# EasyEDA Pro project MasterCtrl.eprj, schematic MasterSchematic_RA

## Sheets
1 MasterCore_RA: Board Name: MasterBoard_RA; Create Date: 2025-10-08; Page Name: MasterCore_RA; Project Name: MasterCtrl; Schematic Name: MasterSchematic_RA; Update Date: 2025-10-08; Company: 嘉立创EDA; Drawed: 王大智; Page Size: A4; Version: V1.0
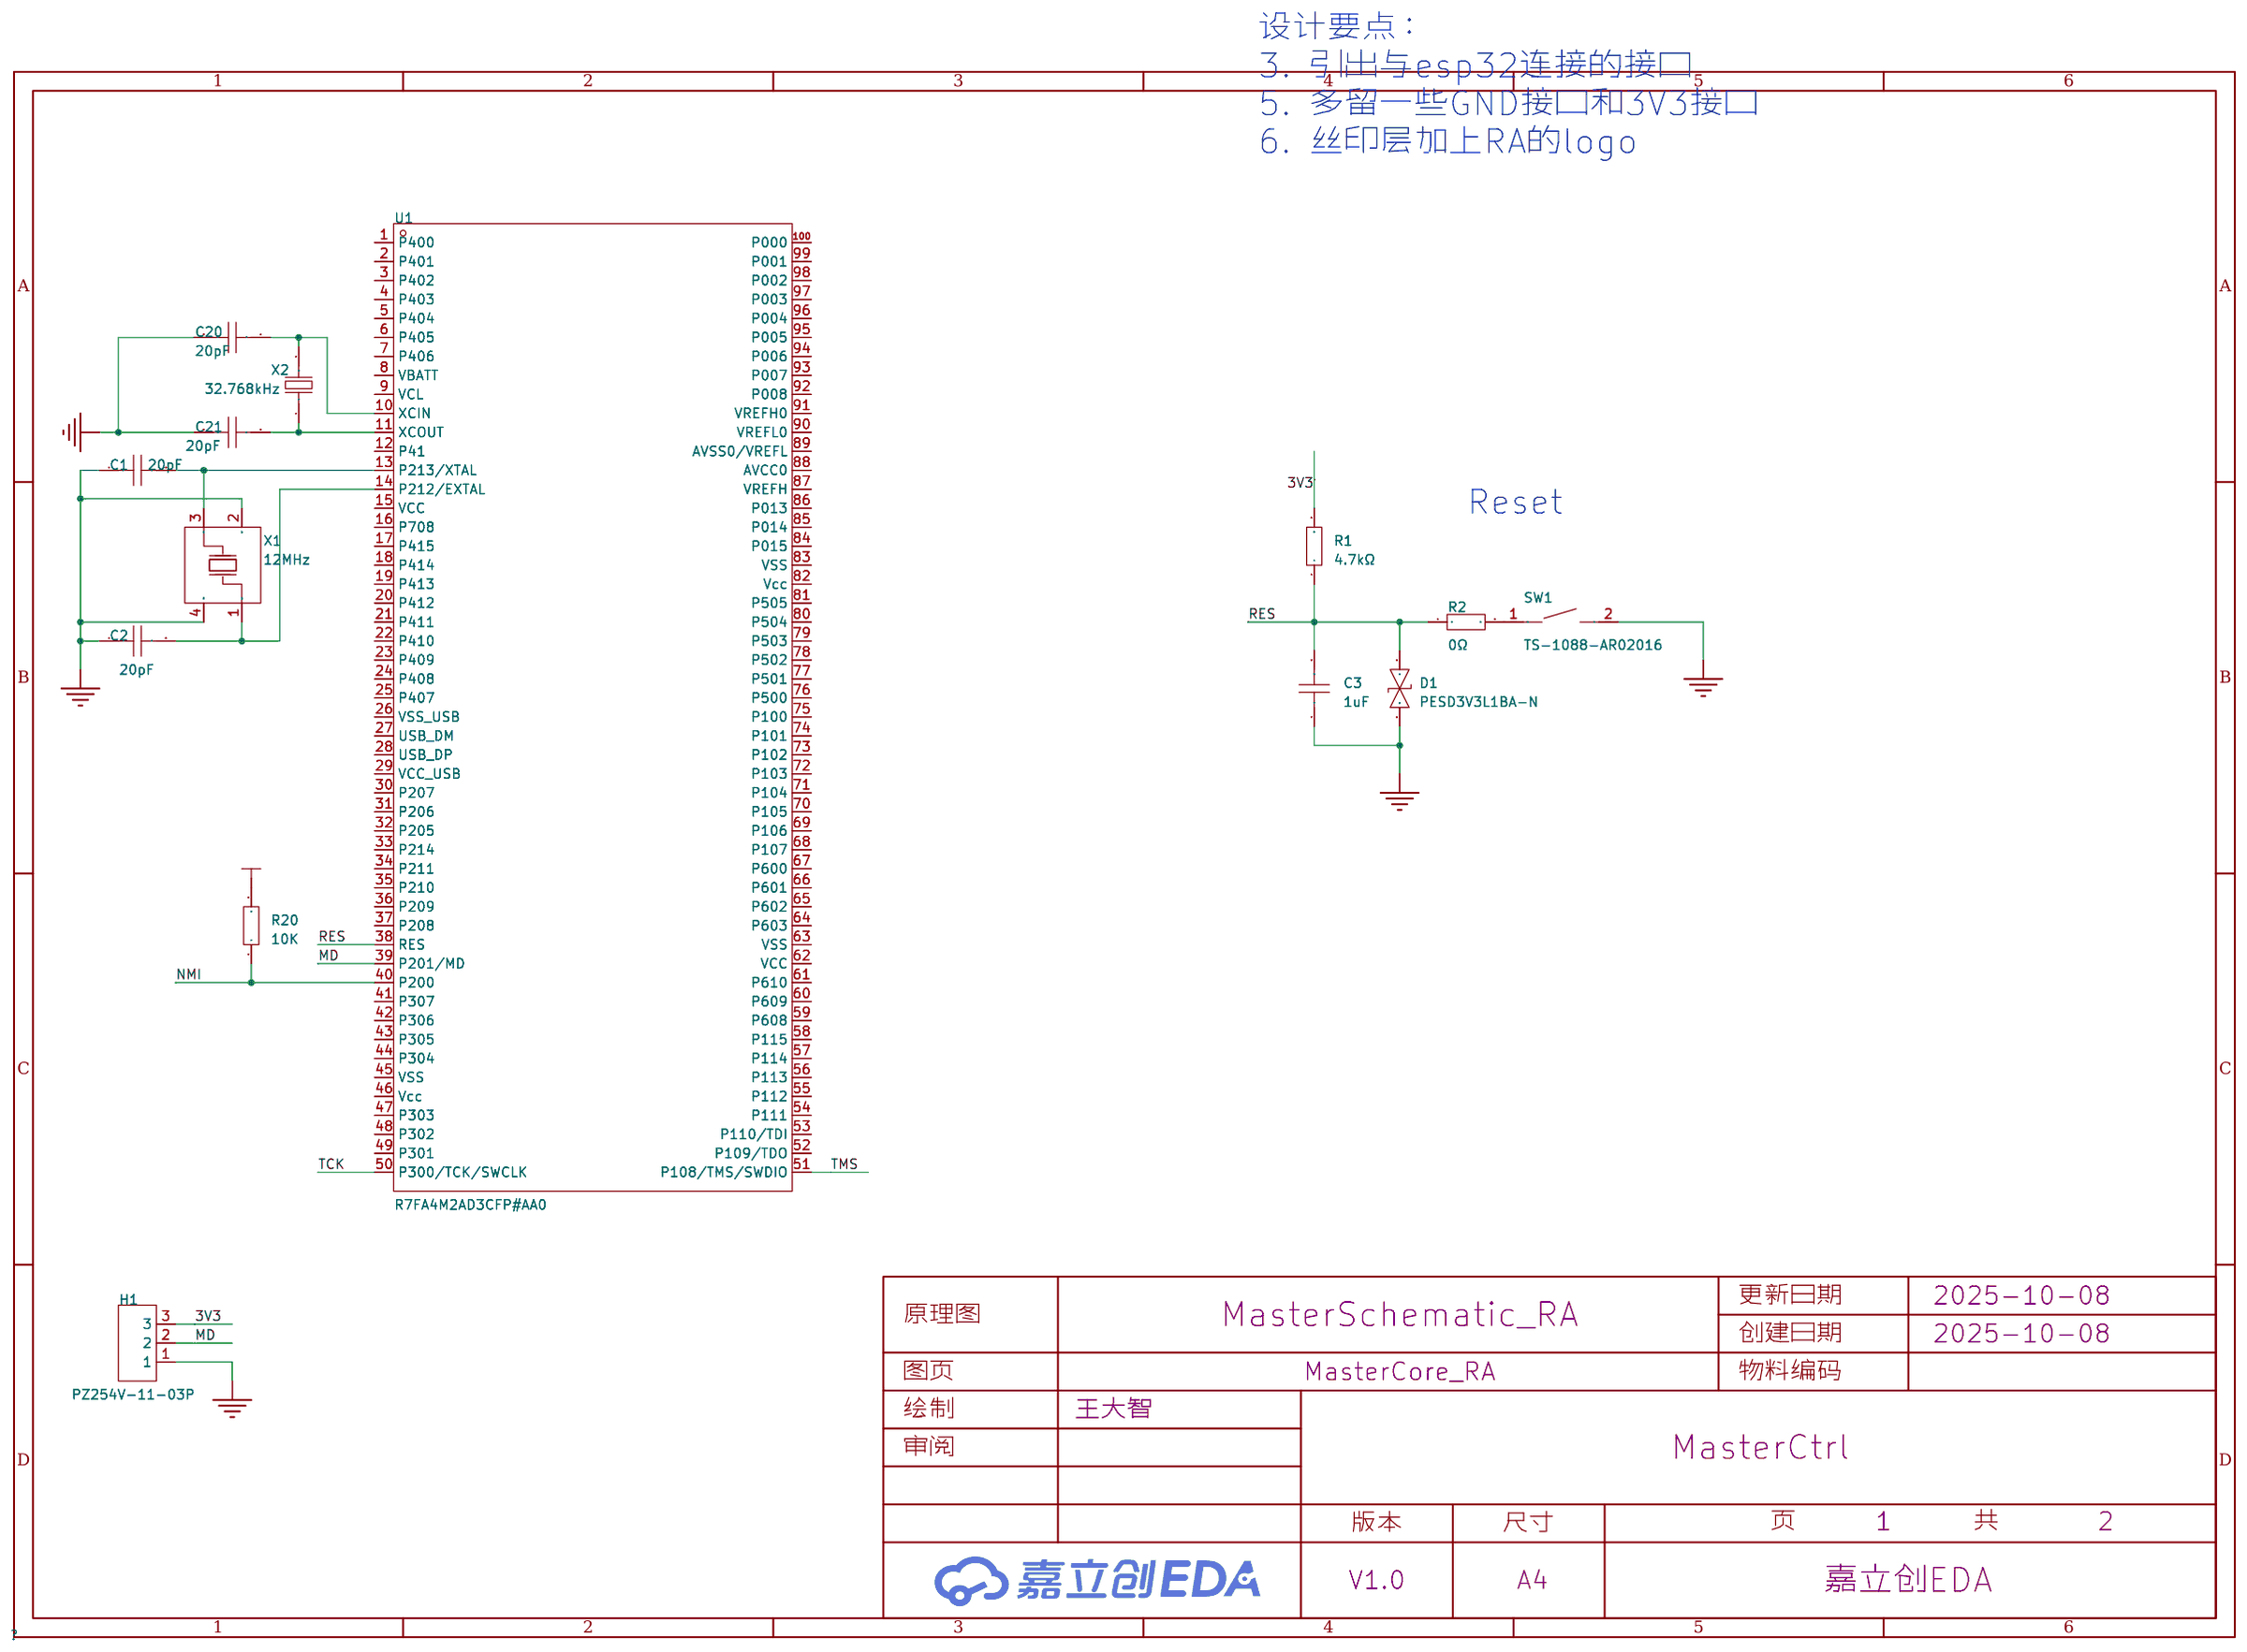
[diagram p4: MasterCore_RA]
2 MasterExternal_RA: Page Name: MasterExternal_RA
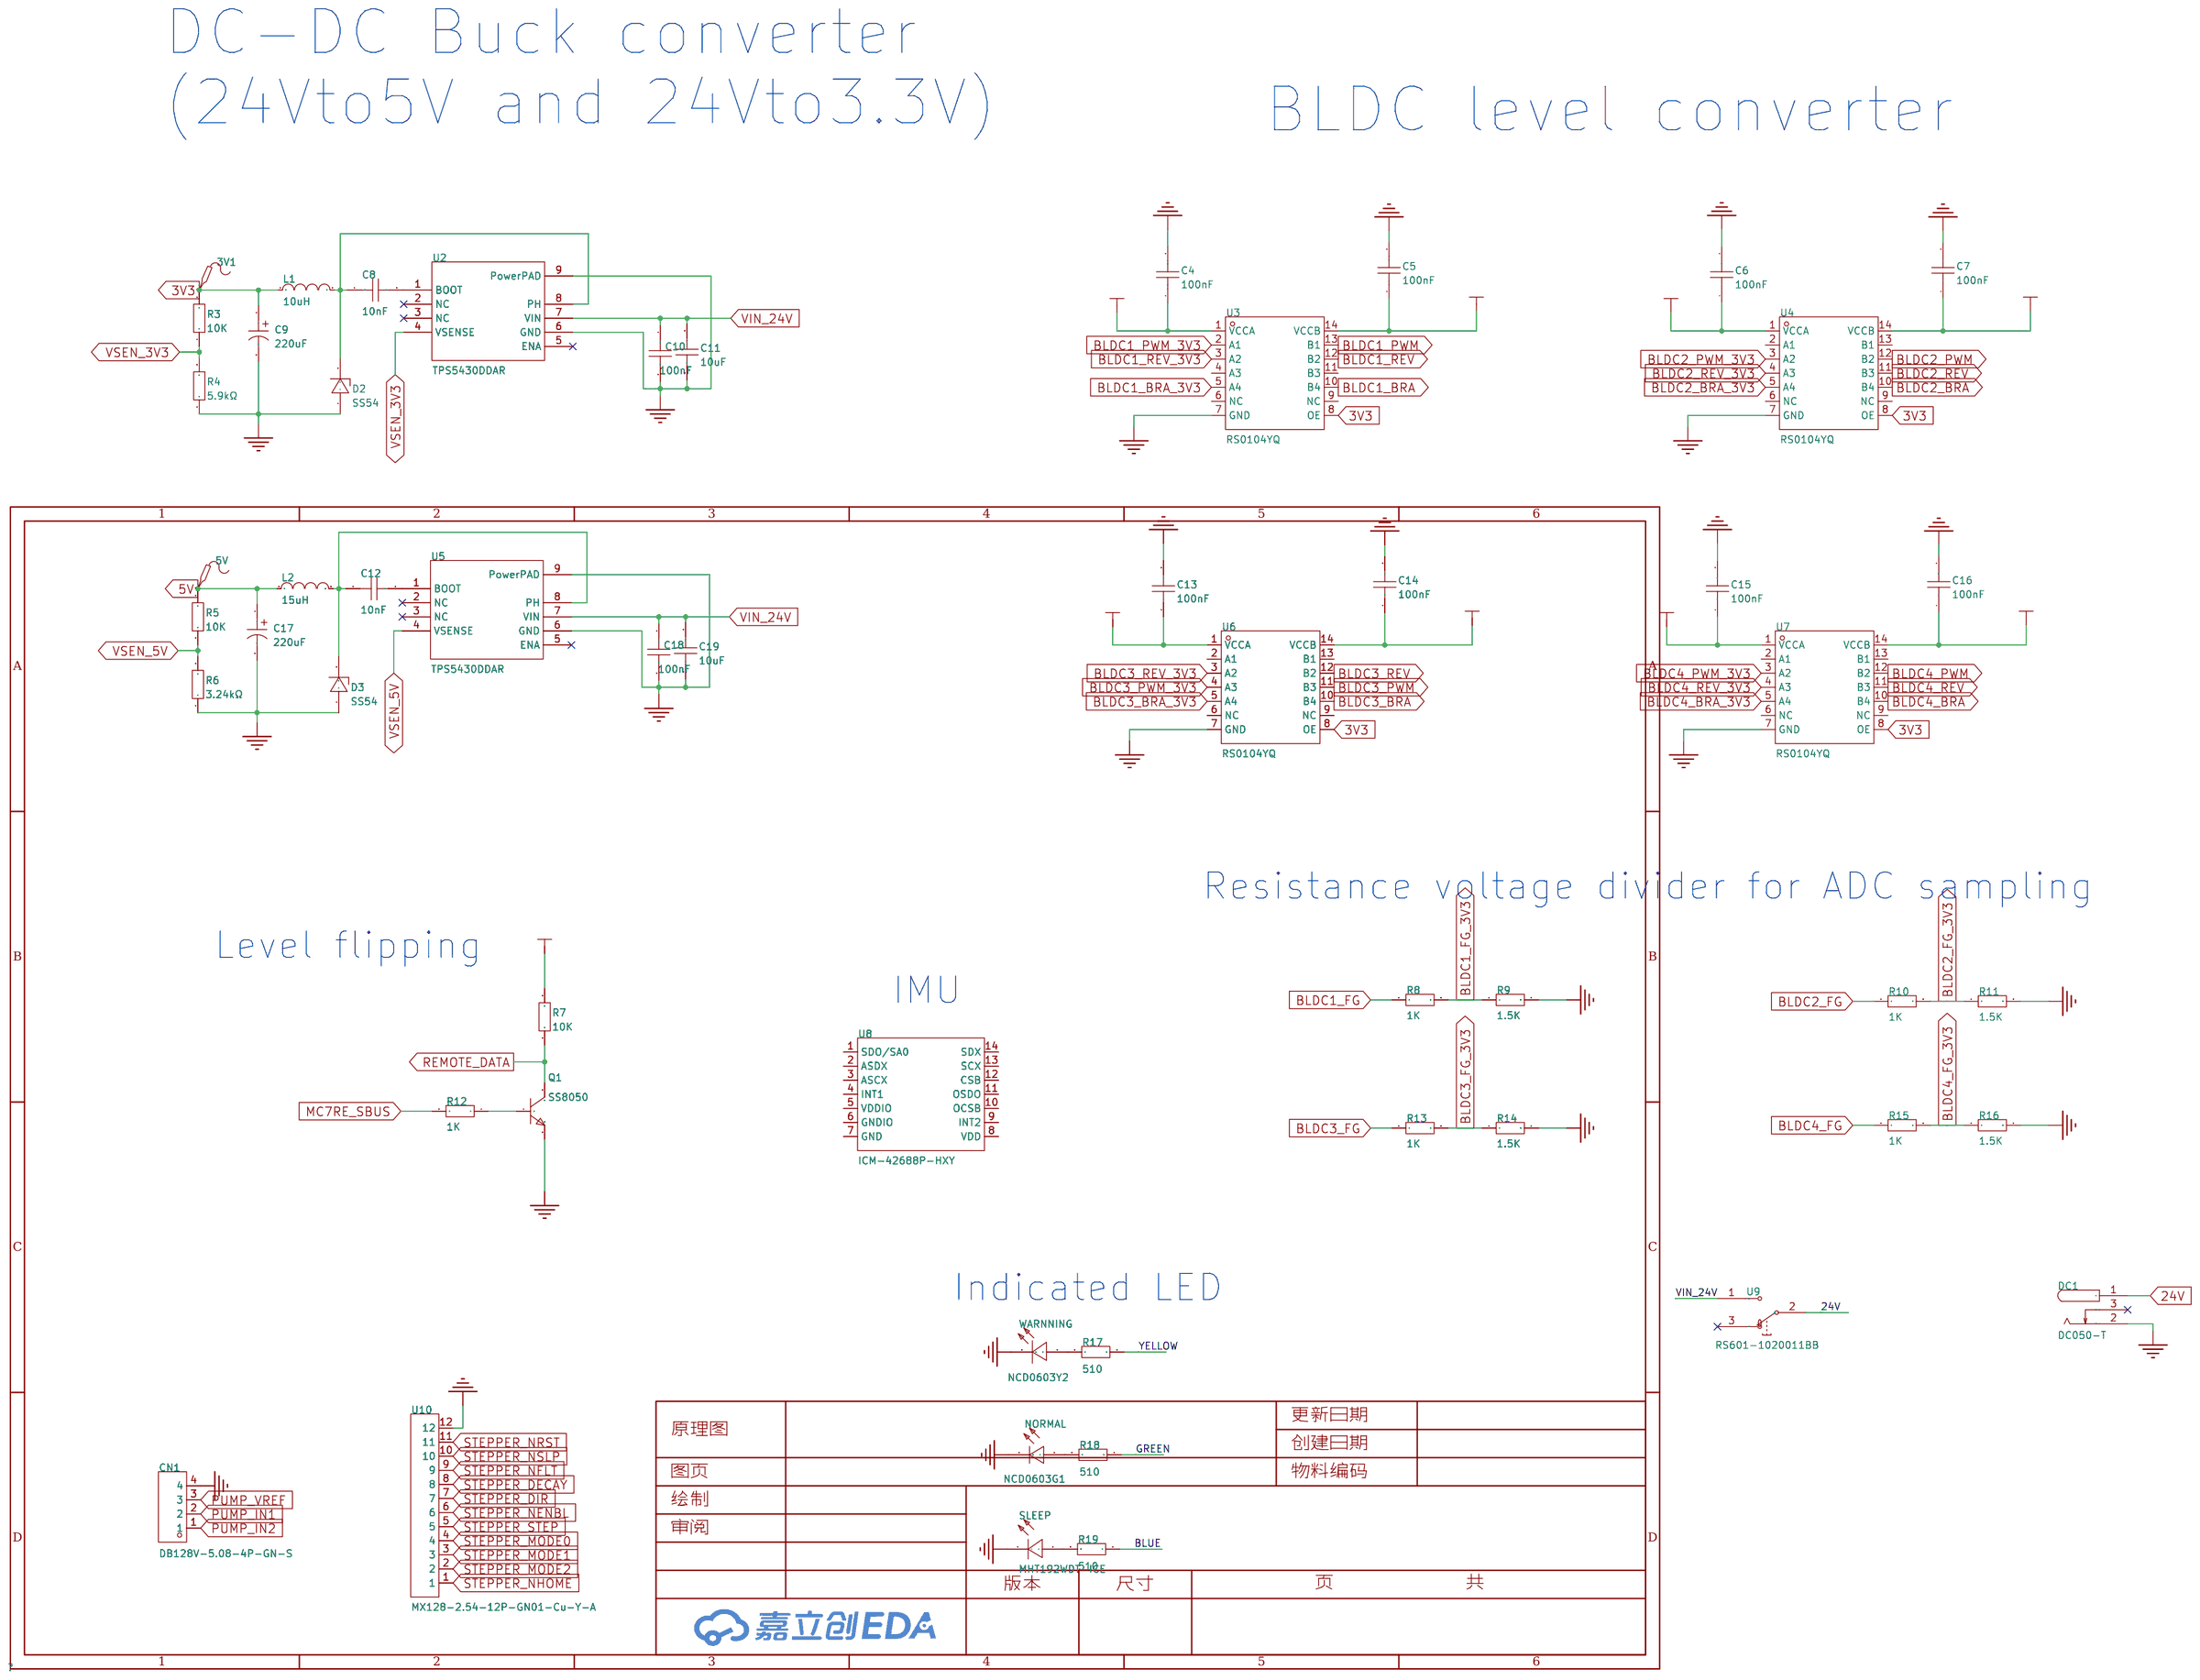
[diagram p5: MasterExternal_RA]

## Parts
sheet MasterCore_RA
C1  20pF  [C0603]
C2  20pF  [C0603]
C3  1uF  [C0603]
C20  20pF  [C0603]
C21  20pF  [C0603]
D1  PESD3V3L1BA-N  [SOD-323_L1.8-W1.3-LS2.5-BI]
H1  PZ254V-11-03P  [HDR-TH_3P-P2.54-V-M]
R1  4.7kΩ  [R0603]
R2  0Ω  [R0603]
R20  10K  [R0603]
SW1  TS-1088-AR02016  [SW-SMD_L3.9-W3.0-P4.45]
U1  R7FA4M2AD3CFP#AA0  [QFP-100_L14.0-W14.0-P0.50-LS16.0-BL]
X1  12MHz  [CRYSTAL-SMD_4P-L3.2-W2.5-BL]
X2  32.768kHz  [FC-135R_L3.2-W1.5]
sheet MasterExternal_RA
3V1  -  [Test-Point-0.5mm]
5V  -  [Test-Point-0.5mm]
C4  100nF  [C0603]
C5  100nF  [C0603]
C6  100nF  [C0603]
C7  100nF  [C0603]
C8  10nF  [C0603]
C9  220uF  [CAP-SMD_BD8.0-L8.3-W8.3-FD]
C10  100nF  [C0603]
C11  10uF  [C1206]
C12  10nF  [C0603]
C13  100nF  [C0603]
C14  100nF  [C0603]
C15  100nF  [C0603]
C16  100nF  [C0603]
C17  220uF  [CAP-SMD_BD8.0-L8.3-W8.3-FD]
C18  100nF  [C0603]
C19  10uF  [C1206]
CN1  DB128V-5.08-4P-GN-S  [CONN-TH_4P-P5.08_DIBO_DB128V-5.08]
D2  SS54  [SMA_L4.3-W2.6-LS5.0-FD]
D3  SS54  [SMA_L4.3-W2.6-LS5.0-FD]
DC1  DC050-T  [DC-IN_DC050-T]
L1  10uH  [IND-SMD_L7.3-W6.8]
L2  15uH  [IND-SMD_L7.0-W6.6_FXL0630]
NORMAL  NCD0603G1  [LED0603-RD_1]
Q1  SS8050  [SOT-23-3_L2.9-W1.3-P1.90-LS2.4-BR]
R3  10K  [R0603]
R4  5.9kΩ  [R0603]
R5  10K  [R0603]
R6  3.24kΩ  [R0603]
R7  10K  [R0603]
R8  1K  [R0603]
R9  1.5K  [R0603]
R10  1K  [R0603]
R11  1.5K  [R0603]
R12  1K  [R0603]
R13  1K  [R0603]
R14  1.5K  [R0603]
R15  1K  [R0603]
R16  1.5K  [R0603]
R17  510  [R0603]
R18  510  [R0603]
R19  510  [R0603]
SLEEP  MHT192WDT-ICE  [LED0603-RD]
U2  TPS5430DDAR  [ESOP-8_L4.9-W3.9-P1.27-LS6.0-TL-EP]
U3  RS0104YQ  [TSSOP-14_L5.0-W4.4-P0.65-LS6.4-BL]
U4  RS0104YQ  [TSSOP-14_L5.0-W4.4-P0.65-LS6.4-BL]
U5  TPS5430DDAR  [ESOP-8_L4.9-W3.9-P1.27-LS6.0-TL-EP]
U6  RS0104YQ  [TSSOP-14_L5.0-W4.4-P0.65-LS6.4-BL]
U7  RS0104YQ  [TSSOP-14_L5.0-W4.4-P0.65-LS6.4-BL]
U8  ICM-42688P-HXY  [LGA-14_L3.0-W2.5-P0.50-TL]
U9  RS601-1020011BB  [SW-TH_RS601-1020011BB]
U10  MX128-2.54-12P-GN01-Cu-Y-A  [CONN-TH_12P-P2.54_MX128-2.54-12P-GN01-CU-Y-A]
WARNNING  NCD0603Y2  [LED0603-RD]

## Library data of the parts
C1 C2 C4-C8 C10 C12-C16 C18 C20 C21 = CAP_0603: Supplier Footprint: 0603
C3 = CL10A105KB8NNNC: LCSC Part Name: 1uF ±10% 50V; Supplier Part: C15849; Manufacturer: SAMSUNG(三星); Supplier Footprint: 0603; JLCPCB Part Class: 基础库; Datasheet: https://item.szlcsc.com/datasheet/CL10A105KB8NNNC/16531.html; Supplier: LCSC; Tolerance: ±10%; Voltage Rating: 50V; Temperature Coefficient: X5R
D1 = PESD3V3L1BA-N: LCSC Part Name: 双向ESD 3.3V截止 峰值浪涌电流：20A@8/20us; Supplier Part: C316020; Manufacturer: BORN(伯恩半导体); Supplier Footprint: SOD-323; JLCPCB Part Class: 扩展库; Datasheet: https://item.szlcsc.com/datasheet/PESD3V3L1BA-N/297708.html; Supplier: LCSC; Polarity: 双向; Reverse Stand-Off Voltage (Vrwm): 3.3V; Clamping Voltage: 24V; Peak Pulse Current (Ipp): 20A@8/20us; Peak Pulse Power Dissipation (Ppp): 480W@8/20us; Voltage - Breakdown: 4V; Reverse Leakage Current (Ir): 1uA; level of protection: IEC 61000-4-4；IEC 61000-4-5；IEC 61000-4-2; Type: ESD; Junction Capacitance: 100pF
H1 = PZ254V-11-03P: LCSC Part Name: 1x3P 间距:2.54mm 方针 直插; Supplier Part: C2937625; Manufacturer: XFCN(兴飞); Supplier Footprint: 插件,P=2.54mm; JLCPCB Part Class: 扩展库; Datasheet: https://item.szlcsc.com/datasheet/PZ254V-11-03P/3293280.html; Supplier: LCSC; Pin Structure: 1x3P; Pitch: 2.54mm; Circluar Pins/Square Pins: 方针; Mounting Type: 直插; Number of Rows: 单排; Number of Pins: 3P; Current Rating: 3A; Voltage Rating (Max): 250V; Length of Mating Pin: 6mm; Insulation Height: 2.5mm; Length of End Connection Pin: 3mm; Operating Temperature: -40℃~+105℃; Color: 黑色
R1 = 0603WAF4701T5E: LCSC Part Name: 4.7kΩ ±1% 100mW 厚膜电阻; Supplier Part: C23162; Manufacturer: UNI-ROYAL(厚声); Supplier Footprint: 0603; JLCPCB Part Class: 基础库; Datasheet: https://item.szlcsc.com/datasheet/0603WAF4701T5E/23889.html; Supplier: LCSC; Type: 厚膜电阻; Tolerance: ±1%; Power(Watts): 100mW; Voltage-Supply(Max): 75V; Temperature Coefficient: ±100ppm/℃; Operating Temperature: -55℃~+155℃
R2 = 0603WAF0000T5E: LCSC Part Name: 0Ω ±1% 100mW 厚膜电阻; Supplier Part: C21189; Manufacturer: UNI-ROYAL(厚声); Supplier Footprint: 0603; JLCPCB Part Class: 基础库; Datasheet: https://item.szlcsc.com/datasheet/0603WAF0000T5E/21903.html; Supplier: LCSC; Type: 厚膜电阻; Tolerance: ±1%; Power(Watts): 100mW; Voltage-Supply(Max): 75V; Operating Temperature: -55℃~+155℃
R3 R5 R7-R20 = Res_0603: Supplier Footprint: 0603
SW1 = TS-1088-AR02016: 电路结构:单刀单掷;按钮形状:圆形按钮;作用力:160gf;安装方式:立贴;开关长度:4mm;开关宽度:3mm;开关高度:2mm;带支架:不带;触点电流:50mA;额定电压(DC):12V;绝缘电阻:100MΩ;机械寿命:10万次;; LCSC Part Name: 4*3*2mm 立贴 轻触开关; Supplier Part: C720477; Manufacturer: XUNPU(讯普); Supplier Footprint: SMD; JLCPCB Part Class: 扩展库; Datasheet: https://atta.szlcsc.com/upload/public/pdf/source/20200810/C720475_60D09DD6C54279ADDB2DC25100F1CC11.pdf; Supplier: LCSC; Circuit: 单刀单掷; Actuator Style: 圆形按钮; Operating Force: 160gf; Mounting Style: 立贴; Switch Length: 4mm; Switch Width: 3mm; Switch Height: 2mm; Strike Gundam: 不带; Contact Current: 50mA; Voltage Rating (DC): 12V; Insulation Resistance: 100MΩ; Actuator/Cap Color: 黑色; Pin Style: SMD接片; Mechanical Life: 10万次; Operating Temperature: -30℃~+80℃
U1 = R7FA4M2AD3CFP#AA0: Supplier Part: C2760247; Manufacturer: RENESAS(瑞萨)/IDT; Supplier Footprint: QFP-100(14x14); JLCPCB Part Class: 扩展库; Datasheet: https://atta.szlcsc.com/upload/public/pdf/source/20220506/333544AE3475D49B174406464DEBF319.pdf; Supplier: LCSC; CPU Core: ARM-M33; CPU Maximum Speed: 100MHz; Program Storage Size: 512KB; EEPROM: 8KB; Number of I/O: 78; ADC (Bit): 12bit; DAC (Bit): 12bit; Voltage - Supply: 2.7V~3.6V
X1 = X322512MSB4SI: 晶振类型:贴片晶振;频率:12MHz;常温频差:±10ppm;负载电容:20pF;频率稳定度:±20ppm;; LCSC Part Name: YSX321SL 12MHZ 4P 3225 20PF ±10PPM -40~85℃ (±20PPM); Supplier Part: C9002; Manufacturer: YXC(扬兴晶振); Supplier Footprint: SMD3225-4P; JLCPCB Part Class: 基础库; Datasheet: https://atta.szlcsc.com/upload/public/pdf/source/20240329/19D5F850207469550BEB00D7DFEDBC7A.pdf; Supplier: LCSC; Type: 贴片晶振; Normal temperature Frequency Tolerance: ±10ppm; Load Capacitance: 20pF; Frequency Stability: ±20ppm; Operating Temperature: -40℃~+85℃
X2 = Q13FC13500004_C32346: 晶振类型:贴片晶振;频率:32.768kHz;常温频差:±20ppm;负载电容:12.5pF;; LCSC Part Name: 32.768kHz ±20ppm 12.5pF; Supplier Part: C32346; Manufacturer: EPSON(爱普生); Manufacturer Part: Q13FC13500004; Supplier Footprint: SMD3215-2P; JLCPCB Part Class: 基础库; Datasheet: https://atta.szlcsc.com/upload/public/pdf/source/20240418/0E0FF5F0356BA3753F616001439D1416.pdf; Supplier: LCSC; Crystal Type: 贴片晶振; Normal temperature Frequency Tolerance: ±20ppm; Load Capacitor: 12.5pF; Equivalent Series Resistance (ESR): 70kΩ; Operating Temperature: -40℃~+85℃
3V1 5V = Test-Point: Test Point 测试点
C9 C17 = GVT1V227M0810CNVC: 容值:220uF;精度:±20%;额定电压:35V;纹波电流:175mA@120Hz;; LCSC Part Name: 220uF ±20% 35V; Supplier Part: C2983323; Manufacturer: HRK(鸿瑞凯电子); Supplier Footprint: SMD,D8xL10.5mm; JLCPCB Part Class: 扩展库; Datasheet: https://atta.szlcsc.com/upload/public/pdf/source/20220321/BA17E910A44EA2B508CDD6AB8BA576BA.pdf; Supplier: LCSC; Tolerance: ±20%; Rated Voltage: 35V; Ripple Current: 175mA@120Hz; φD: 8mm; L: 10.5mm; Lifetime @ Temp: 2000hrs@105℃; Operating Temperature: -55℃~+105℃
C11 C19 = HGC1206R5106K500NSPJ: 容值:10uF;精度:±10%;额定电压:50V;温度系数:X5R;; LCSC Part Name: 10uF ±10% 50V; Supplier Part: C7432781; Manufacturer: Chinocera(华瓷); Supplier Footprint: 1206; JLCPCB Part Class: 扩展库; Datasheet: https://atta.szlcsc.com/upload/public/pdf/source/20240320/FAC3FEC40A78BC5CCCE96C232A94D860.pdf; Supplier: LCSC; Tolerance: ±10%; Voltage Rating: 50V; Temperature Coefficient: X5R
CN1 = DB128V-5.08-4P-GN-S: 结构:1x4P;间距:5.08mm;颜色:绿色;安装方式:直插;排数:1;每排PIN数:4;额定电流:16A;额定电压:300V;线规 - AWG:12~22;线规 - 平方毫米:2.5;工作温度:-40℃~+105℃;; LCSC Part Name: 1x4P 5.08mm 直插 排数:1 每排P数:4; Supplier Part: C2915641; Manufacturer: DORABO(地博电气); Supplier Footprint: 插件,P=5.08mm; JLCPCB Part Class: 扩展库; Datasheet: https://atta.szlcsc.com/upload/public/pdf/source/20230106/CC449C10514519CDCE20F1C37DBF2DAC.pdf; Supplier: LCSC; Number of Positions or Pins: 1x4P; Pitch: 5.08mm; Color: 绿色; Mounting Type: 直插; Number of Pins: 4P; Number of Rows: 1; Number of PINs Per Row: 4; Screw Specification: M2.5; Current Rating: 16A; Voltage Rating (Max): 300V; Wire Gauge - AWG: 12~22; Wire Gauge - mm2: 2.5; Operating Temperature: -40℃~+105℃
D2 D3 = SS54_C7420369: 二极管配置:独立式;正向压降(Vf):550mV@5.0A;直流反向耐压(Vr):40V;整流电流:5A;; LCSC Part Name: 电压:40V 电流:5A; Supplier Part: C7420369; Manufacturer: 宏迦橙; Supplier Footprint: SMA(DO-214AC); JLCPCB Part Class: 扩展库; Datasheet: https://atta.szlcsc.com/upload/public/pdf/source/20230828/254C3882F8647358AD9F60DD73611B5E.pdf; Supplier: LCSC; Diode Configuration: 独立式; Forward Voltage (Vf@If): 550mV@5.0A; Reverse Voltage (Vr): 40V; Rectified Current: 5A; Reverse Leakage Current (Ir): 50uA@40V
DC1 = DC050-T: 连接器类型:DC电源插座;安装方式:卧贴;触点内径:2mm;触点外径:6.4mm;额定电流:2A;额定电压:30V;工作温度范围:-25℃~+70℃;; LCSC Part Name: DC电源插座 内径:2mm 外径:6.4mm; Supplier Part: C431534; Manufacturer: SHOU HAN(首韩); Supplier Footprint: SMD; JLCPCB Part Class: 扩展库; Datasheet: https://atta.szlcsc.com/upload/public/pdf/source/20241230/47AFDAED5CA2AEF49E0D72E48671546A.pdf; Supplier: LCSC; Connector Type: DC电源插座; Mounting Style: 卧贴; Inside Contact Diameter: 2mm; Outside Contact Diameter: 6.4mm; Current Rating (Max): 2A; Voltage Rating (Max): 30V; Operating Temperature Range: -25℃~+70℃
L1 = FXL0630-100-M: 电感值:10uH;精度:±20%;额定电流:4.5A;饱和电流(Isat):5.5A;类型:一体成型电感;; LCSC Part Name: 10uH ±20% 5.5A; Supplier Part: C167223; Manufacturer: cjiang(长江微电); Supplier Footprint: SMD,6.6x7mm; JLCPCB Part Class: 扩展库; Datasheet: https://atta.szlcsc.com/upload/public/pdf/source/20240426/3189EA8206330E2108542F9E34E540E7.pdf; Supplier: LCSC; Tolerance: ±20%; Rated Current: 4.5A; Saturation Current (Isat): 5.5A; DC Resistance (DCR): 68mΩ; Type: 一体成型电感
L2 = FXL0630-150-M: 电感值:15uH;精度:±20%;额定电流:3A;饱和电流(Isat):4.5A;类型:一体成型电感;; LCSC Part Name: 15uH ±20% 4.5A; Supplier Part: C177243; Manufacturer: cjiang(长江微电); Supplier Footprint: SMD,6.6x7mm; JLCPCB Part Class: 扩展库; Datasheet: https://atta.szlcsc.com/upload/public/pdf/source/20240426/3189EA8206330E2108542F9E34E540E7.pdf; Supplier: LCSC; Tolerance: ±20%; Rated Current: 3A; Saturation Current (Isat): 4.5A; DC Resistance (DCR): 115mΩ; Type: 一体成型电感
NORMAL = NCD0603G1: 发光颜色:翠绿色;正向压降(Vf):2.6V~3.6V;功率:72mW;正向电流:20mA;波长:515nm~530nm;透镜颜色:-;发光强度:330mcd~900mcd;发光角度:130°;工作温度:-30℃~+85℃;; Supplier Part: C84267; Manufacturer: 国星光电; Supplier Footprint: 0603; JLCPCB Part Class: 扩展库; Datasheet: https://item.szlcsc.com/datasheet/NCD0603G1/85436.html; Supplier: LCSC; Illumination Color: 翠绿色; Voltage - Forward(Vf): 2.6V~3.6V; Power(Watts): 72mW; Forward Current: 20mA; Wavelength - Dominant: 515nm~530nm; Luminous Intensity: 330mcd~900mcd; Viewing Angle: 130°; Operating Temperature: -30℃~+85℃
Q1 = SS8050_C7420370: 晶体管类型:NPN;集电极电流(Ic):1.5A;集射极击穿电压(Vceo):25V;耗散功率(Pd):300mW;直流电流增益(hFE):120@100mA,1.0V;; LCSC Part Name: H档 200-350; Supplier Part: C7420370; Manufacturer: 宏嘉诚; Supplier Footprint: SOT-23; JLCPCB Part Class: 扩展库; Datasheet: https://atta.szlcsc.com/upload/public/pdf/source/20250205/5DB94E86981B5B1A1866D18E379C0D4F.pdf; Supplier: LCSC; type: NPN; Current - Collector(Ic): 1.5A; Collector - Emitter Voltage VCEO: 25V; Pd - Power Dissipation: 300mW; DC Current Gain: 120@100mA,1.0V; Transition frequency(fT): 100MHz; Current - Collector Cutoff: 100nA; Vce Saturation(VCE(sat)): 500mV; Operating Temperature: -55℃~+150℃
R4 = 0603WAF5901T5E: 电阻类型:厚膜电阻;阻值:5.9kΩ;精度:±1%;功率:100mW;最大工作电压:75V;温度系数:±100ppm/℃;; LCSC Part Name: 5.9kΩ ±1% 100mW 厚膜电阻; Supplier Part: C23071; Manufacturer: UNI-ROYAL(厚声); Supplier Footprint: 0603; JLCPCB Part Class: 扩展库; Datasheet: https://atta.szlcsc.com/upload/public/pdf/source/20200306/C422600_1E6D84923E4A46A82E41ADD87F860B5C.pdf; Supplier: LCSC; Type: 厚膜电阻; Tolerance: ±1%; Power(Watts): 100mW; Overload Voltage (Max): 75V; Temperature Coefficient: ±100ppm/℃; Operating Temperature Range: -55℃~+155℃
R6 = 0603WAF3241T5E: 电阻类型:厚膜电阻;阻值:3.24kΩ;精度:±1%;功率:100mW;最大工作电压:75V;温度系数:±100ppm/℃;; LCSC Part Name: 3.24kΩ ±1% 100mW 厚膜电阻; Supplier Part: C22994; Manufacturer: UNI-ROYAL(厚声); Supplier Footprint: 0603; JLCPCB Part Class: 扩展库; Datasheet: https://atta.szlcsc.com/upload/public/pdf/source/20200306/C422600_1E6D84923E4A46A82E41ADD87F860B5C.pdf; Supplier: LCSC; Type: 厚膜电阻; Tolerance: ±1%; Power(Watts): 100mW; Overload Voltage (Max): 75V; Temperature Coefficient: ±100ppm/℃; Operating Temperature Range: -55℃~+155℃
SLEEP = MHT192WDT-ICE: 发光颜色:冰蓝色;功率:95mW;正向电流:5mA;主波长:-;二极管配置:-;透镜颜色:雾状黄透镜;色温:-;发光角度:130°;载带方式:-;工作温度:-35℃~+85℃;; LCSC Part Name: 蓝灯 冰蓝; Supplier Part: C389522; Manufacturer: MEIHUA(美华); Supplier Footprint: 0603; JLCPCB Part Class: 扩展库; Datasheet: https://atta.szlcsc.com/upload/public/pdf/source/20190515/C389522_27B43B3FF0A26A72E674F8300763D196.pdf; Supplier: LCSC; Emitted Color: 冰蓝色; Power Dissipation: 95mW; Forward Current: 5mA; Lens Color: 雾状黄透镜; Viewing Angle: 130°; Operating Temperature: -35℃~+85℃
U2 U5 = TPS5430DDAR: 功能类型:降压型;输出类型:可调;工作电压:5.5V~36V;输出电压:1.221V~32.04V;输出电流:3A;; LCSC Part Name: 宽输入范围、3A输出电流的降压转换器; Supplier Part: C9864; Manufacturer: TI(德州仪器); Supplier Footprint: SOIC-8-EP; JLCPCB Part Class: 基础库; Datasheet: https://www.ti.com/cn/lit/gpn/tps5430; Supplier: LCSC; Function: 降压型; Output Type: 可调; Input Voltage: 5.5V~36V; Output Voltage: 1.221V~32.04V; Output Current: 3A; Switching Frequency: 500kHz; Operating Temperature: -40℃~+125℃@(TJ); Synchronous Rectification: 否; Number of Outputs: 1; Topology: 降压式; Switch tube (built-in/external): 内置
U3 U4 U6 U7 = RS0104YQ: 数据速率:24Mbps;电压(VCCA):1.65V~5.5V;电压(VCCB):2.3V~5.5V;电路数:1;每个电路通道数:4;; Supplier Part: C2762288; Manufacturer: RUNIC(润石); Supplier Footprint: TSSOP-14; JLCPCB Part Class: 扩展库; Datasheet: https://atta.szlcsc.com/upload/public/pdf/source/20210326/C2762288_047AD9A0F3596B818F72E78761722A97.pdf; Supplier: LCSC; Channel Type: 双向; Data Rate: 24Mbps; Supply Voltage (VCCA): 1.65V~5.5V; Supply Voltage (VCCB): 2.3V~5.5V; Number of Circuits: 1; Channels per Circuit: 4; Output Type: 推挽式；开路漏极; Operating Temperature: -40℃~+85℃
U8 = ICM-42688P-HXY: Supplier Part: C46550687; Manufacturer: HXY MOSFET(华轩阳电子); Supplier Footprint: LGA-14(2.5x3); JLCPCB Part Class: 扩展库; Datasheet: https://item.szlcsc.com/datasheet/ICM-42688P-HXY/48681527.html; Supplier: LCSC
U9 = RS601-1020011BB: 带灯:无;引脚样式:焊片;额定电流:8A;额定电压(AC):250V;额定电压(DC):-;电路结构:单刀双掷;机械寿命:1万次;; Supplier Part: C2885784; Manufacturer: HCTL(华灿天禄); Supplier Footprint: 插件; JLCPCB Part Class: 扩展库; Datasheet: https://atta.szlcsc.com/upload/public/pdf/source/20210820/EDA204CBF6D3843A462B7BF46F14BDE3.pdf; Supplier: LCSC; Switch Length: 21mm; Switch Width: 15mm; Switch Height: 13.6mm; Actuator Type: 凹面弯曲; With Lamp: 无; Pin Style: 焊片; Actuator Color: 黑色; Contact Current: 8A; Voltage Rating (AC): 250V; Circuit: 单刀双掷; Mechanical Life: 1万次; Operating Temperature: -25℃~+85℃; Actuator Identifier: - O
U10 = MX128-2.54-12P-GN01-Cu-Y-A: 结构:1x12P;间距:2.54mm;颜色:绿色;安装方式:直插;排数:1;每排PIN数:12;额定电流:6A;额定电压:150V;线规 - AWG:18~24;线规 - 平方毫米:1;工作温度:-40℃~+105℃;; LCSC Part Name: 1x12P 2.54mm 直插 排数:1 每排P数:12; Supplier Part: C5188451; Manufacturer: MAX(迈旭); Supplier Footprint: 插件,P=2.54mm; JLCPCB Part Class: 扩展库; Datasheet: https://atta.szlcsc.com/upload/public/pdf/source/20250320/39CF67EAC718F5AC600D0D1AE915BA0E.pdf; Supplier: LCSC; Number of Positions or Pins: 1x12P; Pitch: 2.54mm; Color: 绿色; Mounting Type: 直插; Number of Pins: 12P; Number of Rows: 1; Number of PINs Per Row: 12; Screw Specification: M1.6; Current Rating: 6A; Voltage Rating (Max): 150V; Wire Gauge - AWG: 18~24; Wire Gauge - mm2: 1; Operating Temperature: -40℃~+105℃
WARNNING = NCD0603Y2: 发光颜色:黄色;正向电压(VF):1.6V~2.6V;功率:65mW;正向电流:20mA;主波长:586nm~595nm;透镜颜色:无色透明透镜;发光强度:100mcd~220mcd;发光角度:130°;工作温度:-30℃~+85℃;; Supplier Part: C89811; Manufacturer: 国星光电; Supplier Footprint: 0603; JLCPCB Part Class: 扩展库; Datasheet: https://atta.szlcsc.com/upload/public/pdf/source/20200820/C89811_7FE84B429B6BCA3E113B125EE1452576.pdf; Supplier: LCSC; Emitted Color: 黄色; Forward Voltage (VF): 1.6V~2.6V; Power Dissipation: 65mW; Forward Current: 20mA; Dominant Wavelength: 586nm~595nm; Lens Color: 无色透明透镜; Luminous Intensity: 100mcd~220mcd; Viewing Angle: 130°; Operating Temperature: -30℃~+85℃

## Nets
3V3: 3V1.1 C4.1 C6.1 C9.1 C13.1 C15.1 H1.3 L1.1 R1.2 R3.2 R7.2 R20.2 U3.1(VCCA) U3.8(OE) U4.1(VCCA) U4.8(OE) U6.1(VCCA) U6.8(OE) U7.1(VCCA) U7.8(OE)
5V: 5V.1 C5.1 C7.1 C14.1 C16.1 C17.1 L2.1 R5.2 U3.14(VCCB) U4.14(VCCB) U6.14(VCCB) U7.14(VCCB)
24V: DC1.1 U9.2
GND: C1.1 C2.1 C3.1 C4.2 C5.2 C6.2 C7.2 C9.2 C10.2 C11.1 C13.2 C14.2 C15.2 C16.2 C17.2 C18.2 C19.1 C20.2 C21.2 CN1.4 D1.2 D2.1(A) D3.1(A) DC1.2 H1.1 NORMAL.1(K) Q1.2(E) R4.1 R6.1 R9.2 R11.2 R14.2 R16.2 SLEEP.1(-) SW1.2 U2.6(GND) U2.9(PowerPAD) U3.7(GND) U4.7(GND) U5.6(GND) U5.9(PowerPAD) U6.7(GND) U7.7(GND) U10.12 WARNNING.1(K) X1.2(GND) X1.4(GND)
VIN_24V: C10.1 C11.2 C18.1 C19.2 U2.7(VIN) U5.7(VIN) U9.1
BLDC1_BRA: U3.10(B4)
BLDC1_BRA_3V3: U3.5(A4)
BLDC1_FG: R8.1
BLDC1_FG_3V3: R8.2 R9.1
BLDC1_PWM: U3.13(B1)
BLDC1_PWM_3V3: U3.2(A1)
BLDC1_REV: U3.12(B2)
BLDC1_REV_3V3: U3.3(A2)
BLDC2_BRA: U4.10(B4)
BLDC2_BRA_3V3: U4.5(A4)
BLDC2_FG: R10.1
BLDC2_FG_3V3: R10.2 R11.1
BLDC2_PWM: U4.12(B2)
BLDC2_PWM_3V3: U4.3(A2)
BLDC2_REV: U4.11(B3)
BLDC2_REV_3V3: U4.4(A3)
BLDC3_BRA: U6.10(B4)
BLDC3_BRA_3V3: U6.5(A4)
BLDC3_FG: R13.1
BLDC3_FG_3V3: R13.2 R14.1
BLDC3_PWM: U6.11(B3)
BLDC3_PWM_3V3: U6.4(A3)
BLDC3_REV: U6.12(B2)
BLDC3_REV_3V3: U6.3(A2)
BLDC4_BRA: U7.10(B4)
BLDC4_BRA_3V3: U7.5(A4)
BLDC4_FG: R15.1
BLDC4_FG_3V3: R15.2 R16.1
BLDC4_PWM: U7.12(B2)
BLDC4_PWM_3V3: U7.3(A2)
BLDC4_REV: U7.11(B3)
BLDC4_REV_3V3: U7.4(A3)
BLUE: R19.1
GREEN: R18.1
MC7RE_SBUS: R12.2
MD: H1.2 U1.39(P201/MD)
NMI: R20.1 U1.40(P200)
PUMP_IN1: CN1.2
PUMP_IN2: CN1.1
PUMP_VREF: CN1.3
REMOTE_DATA: Q1.3(C) R7.1
RES: C3.2 D1.1 R1.1 R2.1 U1.38(RES)
STEPPER_DECAY: U10.8
STEPPER_DIR: U10.7
STEPPER_MODE0: U10.4
STEPPER_MODE1: U10.3
STEPPER_MODE2: U10.2
STEPPER_NENBL: U10.6
STEPPER_NFLT: U10.9
STEPPER_NHOME: U10.1
STEPPER_NRST: U10.11
STEPPER_NSLP: U10.10
STEPPER_STEP: U10.5
TCK: U1.50(P300/TCK/SWCLK)
TMS: U1.51(P108/TMS/SWDIO)
VSEN_3V3: R3.1 R4.2 U2.4(VSENSE)
VSEN_5V: R5.1 R6.2 U5.4(VSENSE)
YELLOW: R17.1
Net-(C1-2): C1.2 U1.13(P213/XTAL) X1.3(OSC2)
Net-(C2-2): C2.2 U1.14(P212/EXTAL) X1.1(OSC1)
Net-(C8-1): C8.1 D2.2(K) L1.2 U2.8(PH)
Net-(C8-2): C8.2 U2.1(BOOT)
Net-(C12-1): C12.1 D3.2(K) L2.2 U5.8(PH)
Net-(C12-2): C12.2 U5.1(BOOT)
Net-(C20-1): C20.1 U1.10(XCIN) X2.2
Net-(C21-1): C21.1 U1.11(XCOUT) X2.1
Net-(NORMAL-2): NORMAL.2(A) R18.2
Net-(Q1-1): Q1.1(B) R12.1
Net-(R2-2): R2.2 SW1.1
Net-(R17-2): R17.2 WARNNING.2(A)
Net-(R19-2): R19.2 SLEEP.2(+)

Not connected (* = marked no-connect by the designer): DC1 3*; U1 1(P400) 2(P401) 3(P402) 4(P403) 5(P404) 6(P405) 7(P406) 8(VBATT) 9(VCL) 12(P41) 15(VCC) 16(P708) 17(P415) 18(P414) 19(P413) 20(P412) 21(P411) 22(P410) 23(P409) 24(P408) 25(P407) 26(VSS_USB) 27(USB_DM) 28(USB_DP) 29(VCC_USB) 30(P207) 31(P206) 32(P205) 33(P214) 34(P211) 35(P210) 36(P209) 37(P208) 41(P307) 42(P306) 43(P305) 44(P304) 45(VSS) 46(Vcc) 47(P303) 48(P302) 49(P301) 52(P109/TDO) 53(P110/TDI) 54(P111) 55(P112) 56(P113) 57(P114) 58(P115) 59(P608) 60(P609) 61(P610) 62(VCC) 63(VSS) 64(P603) 65(P602) 66(P601) 67(P600) 68(P107) 69(P106) 70(P105) 71(P104) 72(P103) 73(P102) 74(P101) 75(P100) 76(P500) 77(P501) 78(P502) 79(P503) 80(P504) 81(P505) 82(Vcc) 83(VSS) 84(P015) 85(P014) 86(P013) 87(VREFH) 88(AVCC0) 89(AVSS0/VREFL) 90(VREFL0) 91(VREFH0) 92(P008) 93(P007) 94(P006) 95(P005) 96(P004) 97(P003) 98(P002) 99(P001) 100(P000); U2 2(NC)* 3(NC)* 5(ENA)*; U3 4(A3) 6(NC) 9(NC) 11(B3); U4 2(A1) 6(NC) 9(NC) 13(B1); U5 2(NC)* 3(NC)* 5(ENA)*; U6 2(A1) 6(NC) 9(NC) 13(B1); U7 2(A1) 6(NC) 9(NC) 13(B1); U8 1(SDO/SA0) 2(ASDX) 3(ASCX) 4(INT1) 5(VDDIO) 6(GNDIO) 7(GND) 8(VDD) 9(INT2) 10(OCSB) 11(OSDO) 12(CSB) 13(SCX) 14(SDX); U9 3*

## Notes on the sheets
sheet 1
- 设计要点：
  3. 引出与esp32连接的接口
  5. 多留一些GND接口和3V3接口
  6. 丝印层加上RA的logo
- Reset
sheet 2
- DC-DC Buck converter
  (24Vto5V and 24Vto3.3V)
- BLDC level converter
- Resistance voltage divider for ADC sampling
- Level flipping
- IMU
- Indicated LED
